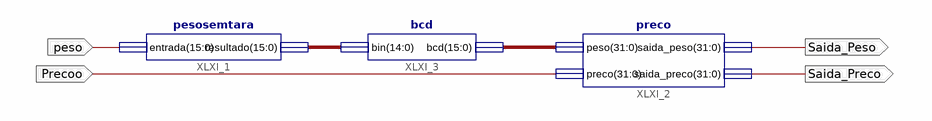
[diagram p0: schematic sheet 1]
// Xilinx ISE schematic esquema.sch (artix7) as structural Verilog: 3 symbols, 4 ports
module esquema (
  input  peso,
  input  Precoo,
  output Saida_Preco,
  output Saida_Peso
);

  wire [14:0] XLXN_1;
  wire [31:0] XLXN_2;

  pesosemtara XLXI_1 (.entrada({16{peso}}), .resultado(XLXN_1));
  bcd XLXI_3 (.bin(XLXN_1), .bcd(XLXN_2));
  preco XLXI_2 (.peso(XLXN_2), .preco({32{Precoo}}), .saida_peso({32{Saida_Peso}}), .saida_preco({32{Saida_Preco}}));
endmodule
